# EAGLE schematic 7-jack-sensor-board (EAGLE 9.6.2)
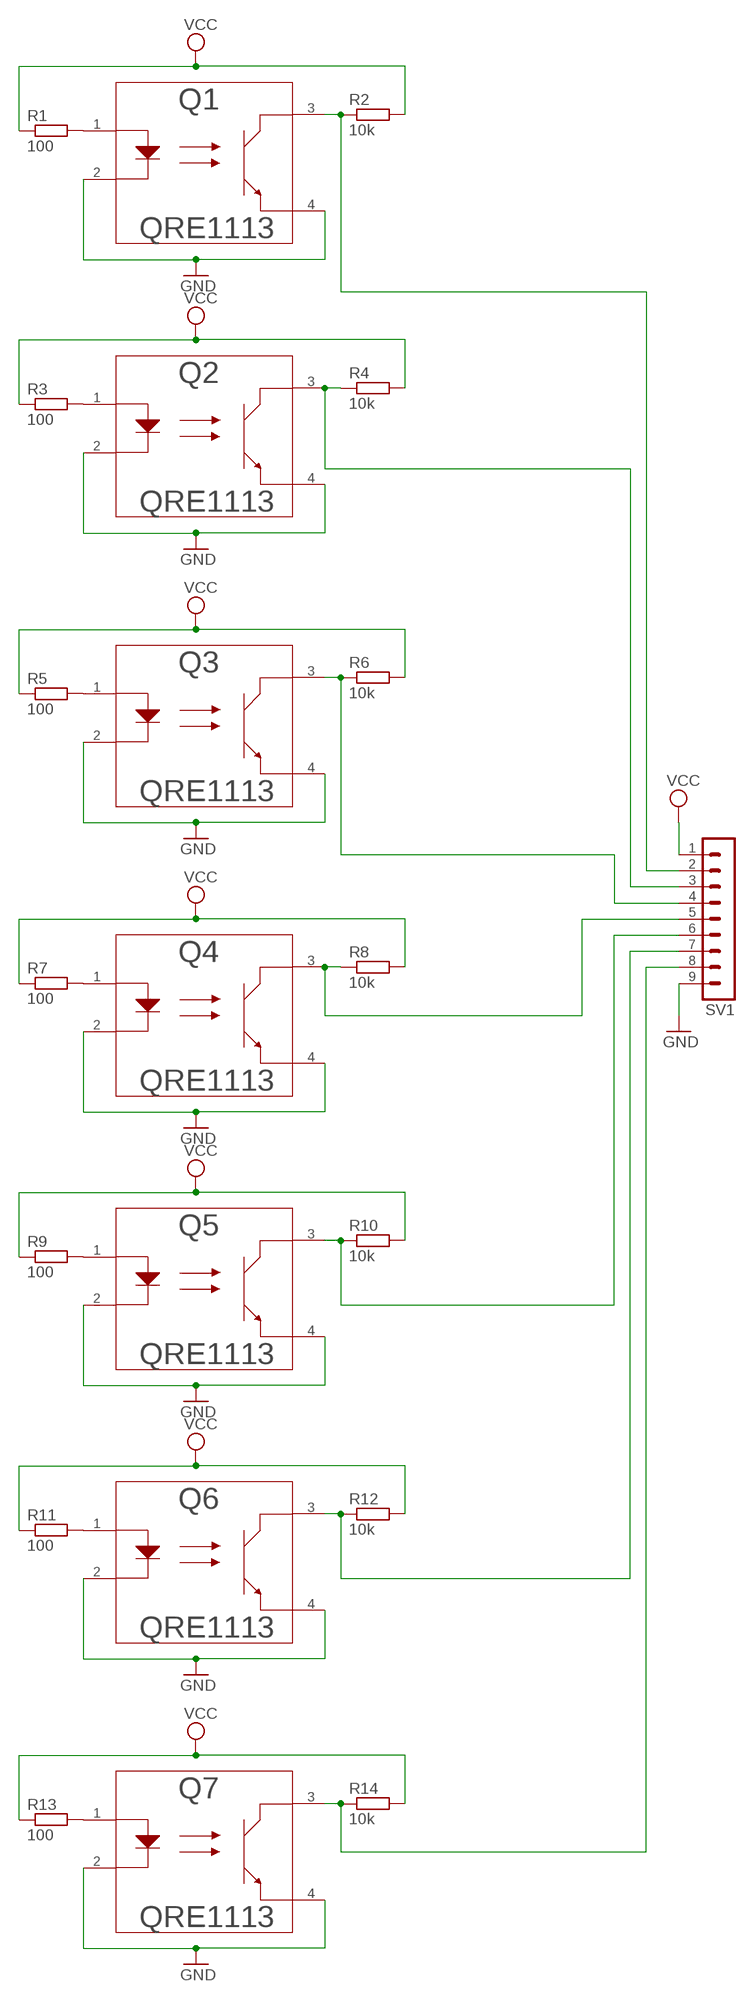
[diagram p0: schematic, sheet 1]

## Parts
Q1  QRE1113  [DIP4_100AQ_ONS]
Q2  QRE1113  [DIP4_100AQ_ONS]
Q3  QRE1113  [DIP4_100AQ_ONS]
Q4  QRE1113  [DIP4_100AQ_ONS]
Q5  QRE1113  [DIP4_100AQ_ONS]
Q6  QRE1113  [DIP4_100AQ_ONS]
Q7  QRE1113  [DIP4_100AQ_ONS]
R1  100  R-EU_0207/10  [0207/10]
R2  10k  R-EU_0207/10  [0207/10]
R3  100  R-EU_0207/10  [0207/10]
R4  10k  R-EU_0207/10  [0207/10]
R5  100  R-EU_0207/10  [0207/10]
R6  10k  R-EU_0207/10  [0207/10]
R7  100  R-EU_0207/10  [0207/10]
R8  10k  R-EU_0207/10  [0207/10]
R9  100  R-EU_0207/10  [0207/10]
R10  10k  R-EU_0207/10  [0207/10]
R11  100  R-EU_0207/10  [0207/10]
R12  10k  R-EU_0207/10  [0207/10]
R13  100  R-EU_0207/10  [0207/10]
R14  10k  R-EU_0207/10  [0207/10]
SV1  MA09-1  [MA09-1]

## Nets
GND: Q1.2 Q1.4 Q2.2 Q2.4 Q3.2 Q3.4 Q4.2 Q4.4 Q5.2 Q5.4 Q6.2 Q6.4 Q7.2 Q7.4 SV1.9
N$1: Q1.1 R1.2
N$2: Q1.3 R2.1 SV1.2
N$3: Q2.1 R3.2
N$4: Q2.3 R4.1 SV1.3
N$5: Q3.1 R5.2
N$6: Q3.3 R6.1 SV1.4
N$7: Q4.1 R7.2
N$8: Q4.3 R8.1 SV1.5
N$9: Q5.1 R9.2
N$10: Q5.3 R10.1 SV1.6
N$11: Q6.1 R11.2
N$12: Q6.3 R12.1 SV1.7
N$13: Q7.1 R13.2
N$14: Q7.3 R14.1 SV1.8
VCC: R1.1 R2.2 R3.1 R4.2 R5.1 R6.2 R7.1 R8.2 R9.1 R10.2 R11.1 R12.2 R13.1 R14.2 SV1.1

## Library data of the parts
Q1-Q7 = qre1113:QRE1113; COPYRIGHT: Copyright (C) 2024 Ultra Librarian. All rights reserved.; MANUFACTURER_PART_NUMBER: QRE1113; MFR_NAME: onsemi
R1-R14 = rcl:R-EU_: RESISTOR, European symbol; SPICEPREFIX: R
SV1 = con-lstb:MA09-1: PIN HEADER; OC_FARNELL: unknown; OC_NEWARK: unknown